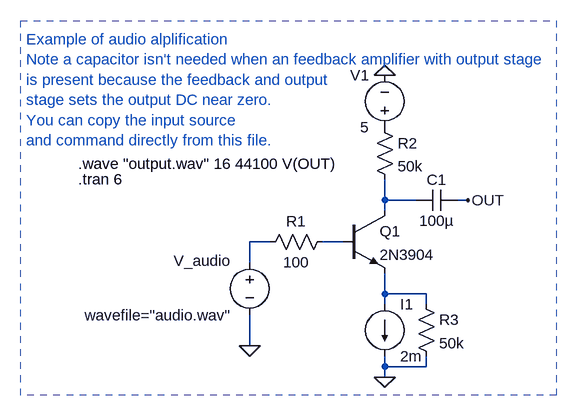
[diagram p0: schematic Audio_Example.asc]
Audio_Example.asc, the LTspice schematic file:
Version 4
SHEET 1 1496 680
WIRE 336 128 336 96
WIRE 384 128 336 128
WIRE 464 128 448 128
WIRE 336 144 336 128
WIRE 160 192 128 192
WIRE 272 192 240 192
WIRE 128 224 128 192
WIRE 336 272 336 240
WIRE 400 272 336 272
WIRE 336 288 336 272
WIRE 400 288 400 272
WIRE 128 352 128 304
WIRE 336 384 336 368
WIRE 400 384 400 368
WIRE 400 384 336 384
WIRE 336 400 336 384
FLAG 336 400 0
FLAG 336 -64 0
FLAG 128 352 0
FLAG 464 128 OUT
SYMBOL npn 272 144 R0
SYMATTR InstName Q1
SYMATTR Value 2N3904
SYMBOL Voltage 336 32 R180
WINDOW 0 24 96 Left 2
WINDOW 3 24 16 Left 2
SYMATTR InstName V1
SYMATTR Value 5
SYMBOL voltage 128 208 R0
WINDOW 123 -254 97 Left 2
WINDOW 39 0 0 Left 0
WINDOW 3 -203 98 Left 2
WINDOW 0 -117 13 Left 2
SYMATTR Value2 wavefile="audio.wav"
SYMATTR Value ""
SYMATTR InstName V_audio
SYMBOL Res 256 176 R90
WINDOW 0 0 56 VBottom 2
WINDOW 3 32 56 VTop 2
SYMATTR InstName R1
SYMATTR Value 100
SYMBOL Res 320 0 R0
SYMATTR InstName R2
SYMATTR Value 50k
SYMBOL current 336 288 R0
SYMATTR InstName I1
SYMATTR Value 2m
SYMBOL Res 384 272 R0
SYMATTR InstName R3
SYMATTR Value 50k
SYMBOL Cap 448 112 R90
WINDOW 0 0 32 VBottom 2
WINDOW 3 32 32 VTop 2
SYMATTR InstName C1
SYMATTR Value 100µ
TEXT -136 72 Left 2 !.wave "output.wav" 16 44100 V(OUT)
TEXT -136 96 Left 2 !.tran 6
TEXT -216 -120 Left 2 ;Example of audio alplification\nNote a capacitor isn't needed when an feedback amplifier with output stage\nis present because the feedback and output\nstage sets the output DC near zero.\nYou can copy the input source \nand command directly from this file.
RECTANGLE Normal -224 -148 600 428 3

The netlist it stands for:
* Audio_Example.asc
Q1 N001 N003 N004 0 2N3904
V1 P001 0 5
V_audio N002 0 wavefile="audio.wav"
R1 N003 N002 100
R2 P001 N001 50k
I1 N004 0 2m
R3 N004 0 50k
C1 OUT N001 100µ
.model NPN NPN
.model PNP PNP
.lib standard.bjt
.wave "output.wav" 16 44100 V(OUT)
.tran 6
* Example of audio alplification
* Note a capacitor isn't needed when an feedback amplifier with output stage
* is present because the feedback and output
* stage sets the output DC near zero.
* You can copy the input source
* and command directly from this file.
.backanno
.end